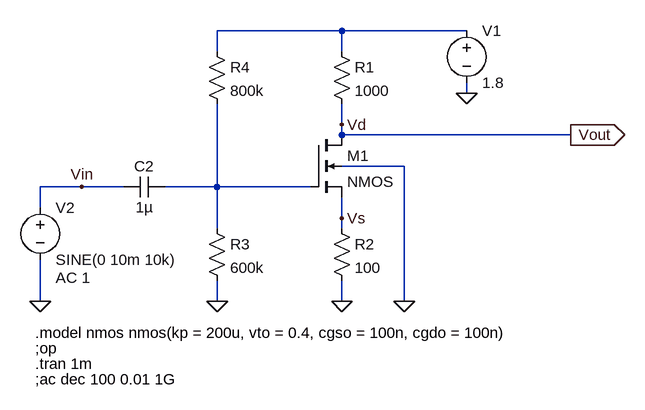
[diagram p0: schematic CS Amplifier.asc]
CS Amplifier.asc, the LTspice schematic file:
Version 4
SHEET 1 880 680
WIRE 224 -48 32 -48
WIRE 416 -48 224 -48
WIRE 32 -16 32 -48
WIRE 224 -16 224 -48
WIRE 416 48 416 32
WIRE 224 96 224 64
WIRE 224 112 224 96
WIRE 576 112 224 112
WIRE 320 160 224 160
WIRE -176 192 -240 192
WIRE -112 192 -176 192
WIRE 32 192 32 64
WIRE 32 192 -48 192
WIRE 176 192 32 192
WIRE -240 224 -240 192
WIRE 224 240 224 208
WIRE 32 256 32 192
WIRE 224 256 224 240
WIRE -240 368 -240 304
WIRE 32 368 32 336
WIRE 224 368 224 336
WIRE 320 368 320 160
FLAG 32 368 0
FLAG 224 368 0
FLAG 320 368 0
FLAG 416 48 0
FLAG -240 368 0
FLAG 224 240 Vs
FLAG 576 112 Vout
IOPIN 576 112 Out
FLAG 224 96 Vd
FLAG -176 192 Vin
SYMBOL nmos4 176 112 R0
SYMATTR InstName M1
SYMATTR Value2 l=1u w=250u
SYMBOL res 208 -32 R0
SYMATTR InstName R1
SYMATTR Value 1000
SYMBOL res 208 240 R0
SYMATTR InstName R2
SYMATTR Value 100
SYMBOL res 16 240 R0
SYMATTR InstName R3
SYMATTR Value 600k
SYMBOL res 16 -32 R0
SYMATTR InstName R4
SYMATTR Value 800k
SYMBOL voltage 416 -64 R0
WINDOW 123 0 0 Left 0
WINDOW 39 0 0 Left 0
SYMATTR InstName V1
SYMATTR Value 1.8
SYMBOL cap -48 176 R90
WINDOW 0 0 32 VBottom 2
WINDOW 3 32 32 VTop 2
SYMATTR InstName C2
SYMATTR Value 1µ
SYMBOL voltage -240 208 R0
WINDOW 123 24 124 Left 2
WINDOW 39 0 0 Left 0
SYMATTR Value2 AC 1
SYMATTR InstName V2
SYMATTR Value SINE(0 10m 10k)
TEXT -248 416 Left 2 !.model nmos nmos(kp = 200u, vto = 0.4, cgso = 100n, cgdo = 100n)
TEXT -248 440 Left 2 !;op
TEXT -248 464 Left 2 !.tran 1m
TEXT -248 488 Left 2 !;ac dec 100 0.01 1G

The netlist it stands for:
* CS Amplifier.asc
M1 Vd N002 Vs 0 NMOS l=1u w=250u
R1 N001 Vd 1000
R2 Vs 0 100
R3 N002 0 600k
R4 N001 N002 800k
V1 N001 0 1.8
C2 N002 Vin 1µ
V2 Vin 0 SINE(0 10m 10k) AC 1
.model NMOS NMOS
.model PMOS PMOS
.lib standard.mos
.model nmos nmos(kp = 200u, vto = 0.4, cgso = 100n, cgdo = 100n)
;op
.tran 1m
;ac dec 100 0.01 1G
.backanno
.end